# EasyEDA schematic SCH_AudioSwitcher_2026-03-13.json
TITLE: Audio Switcher; REV: 1.0; Date: 2026-03-10; Sheet: 1/1; Drawn By: CBH; Company: no
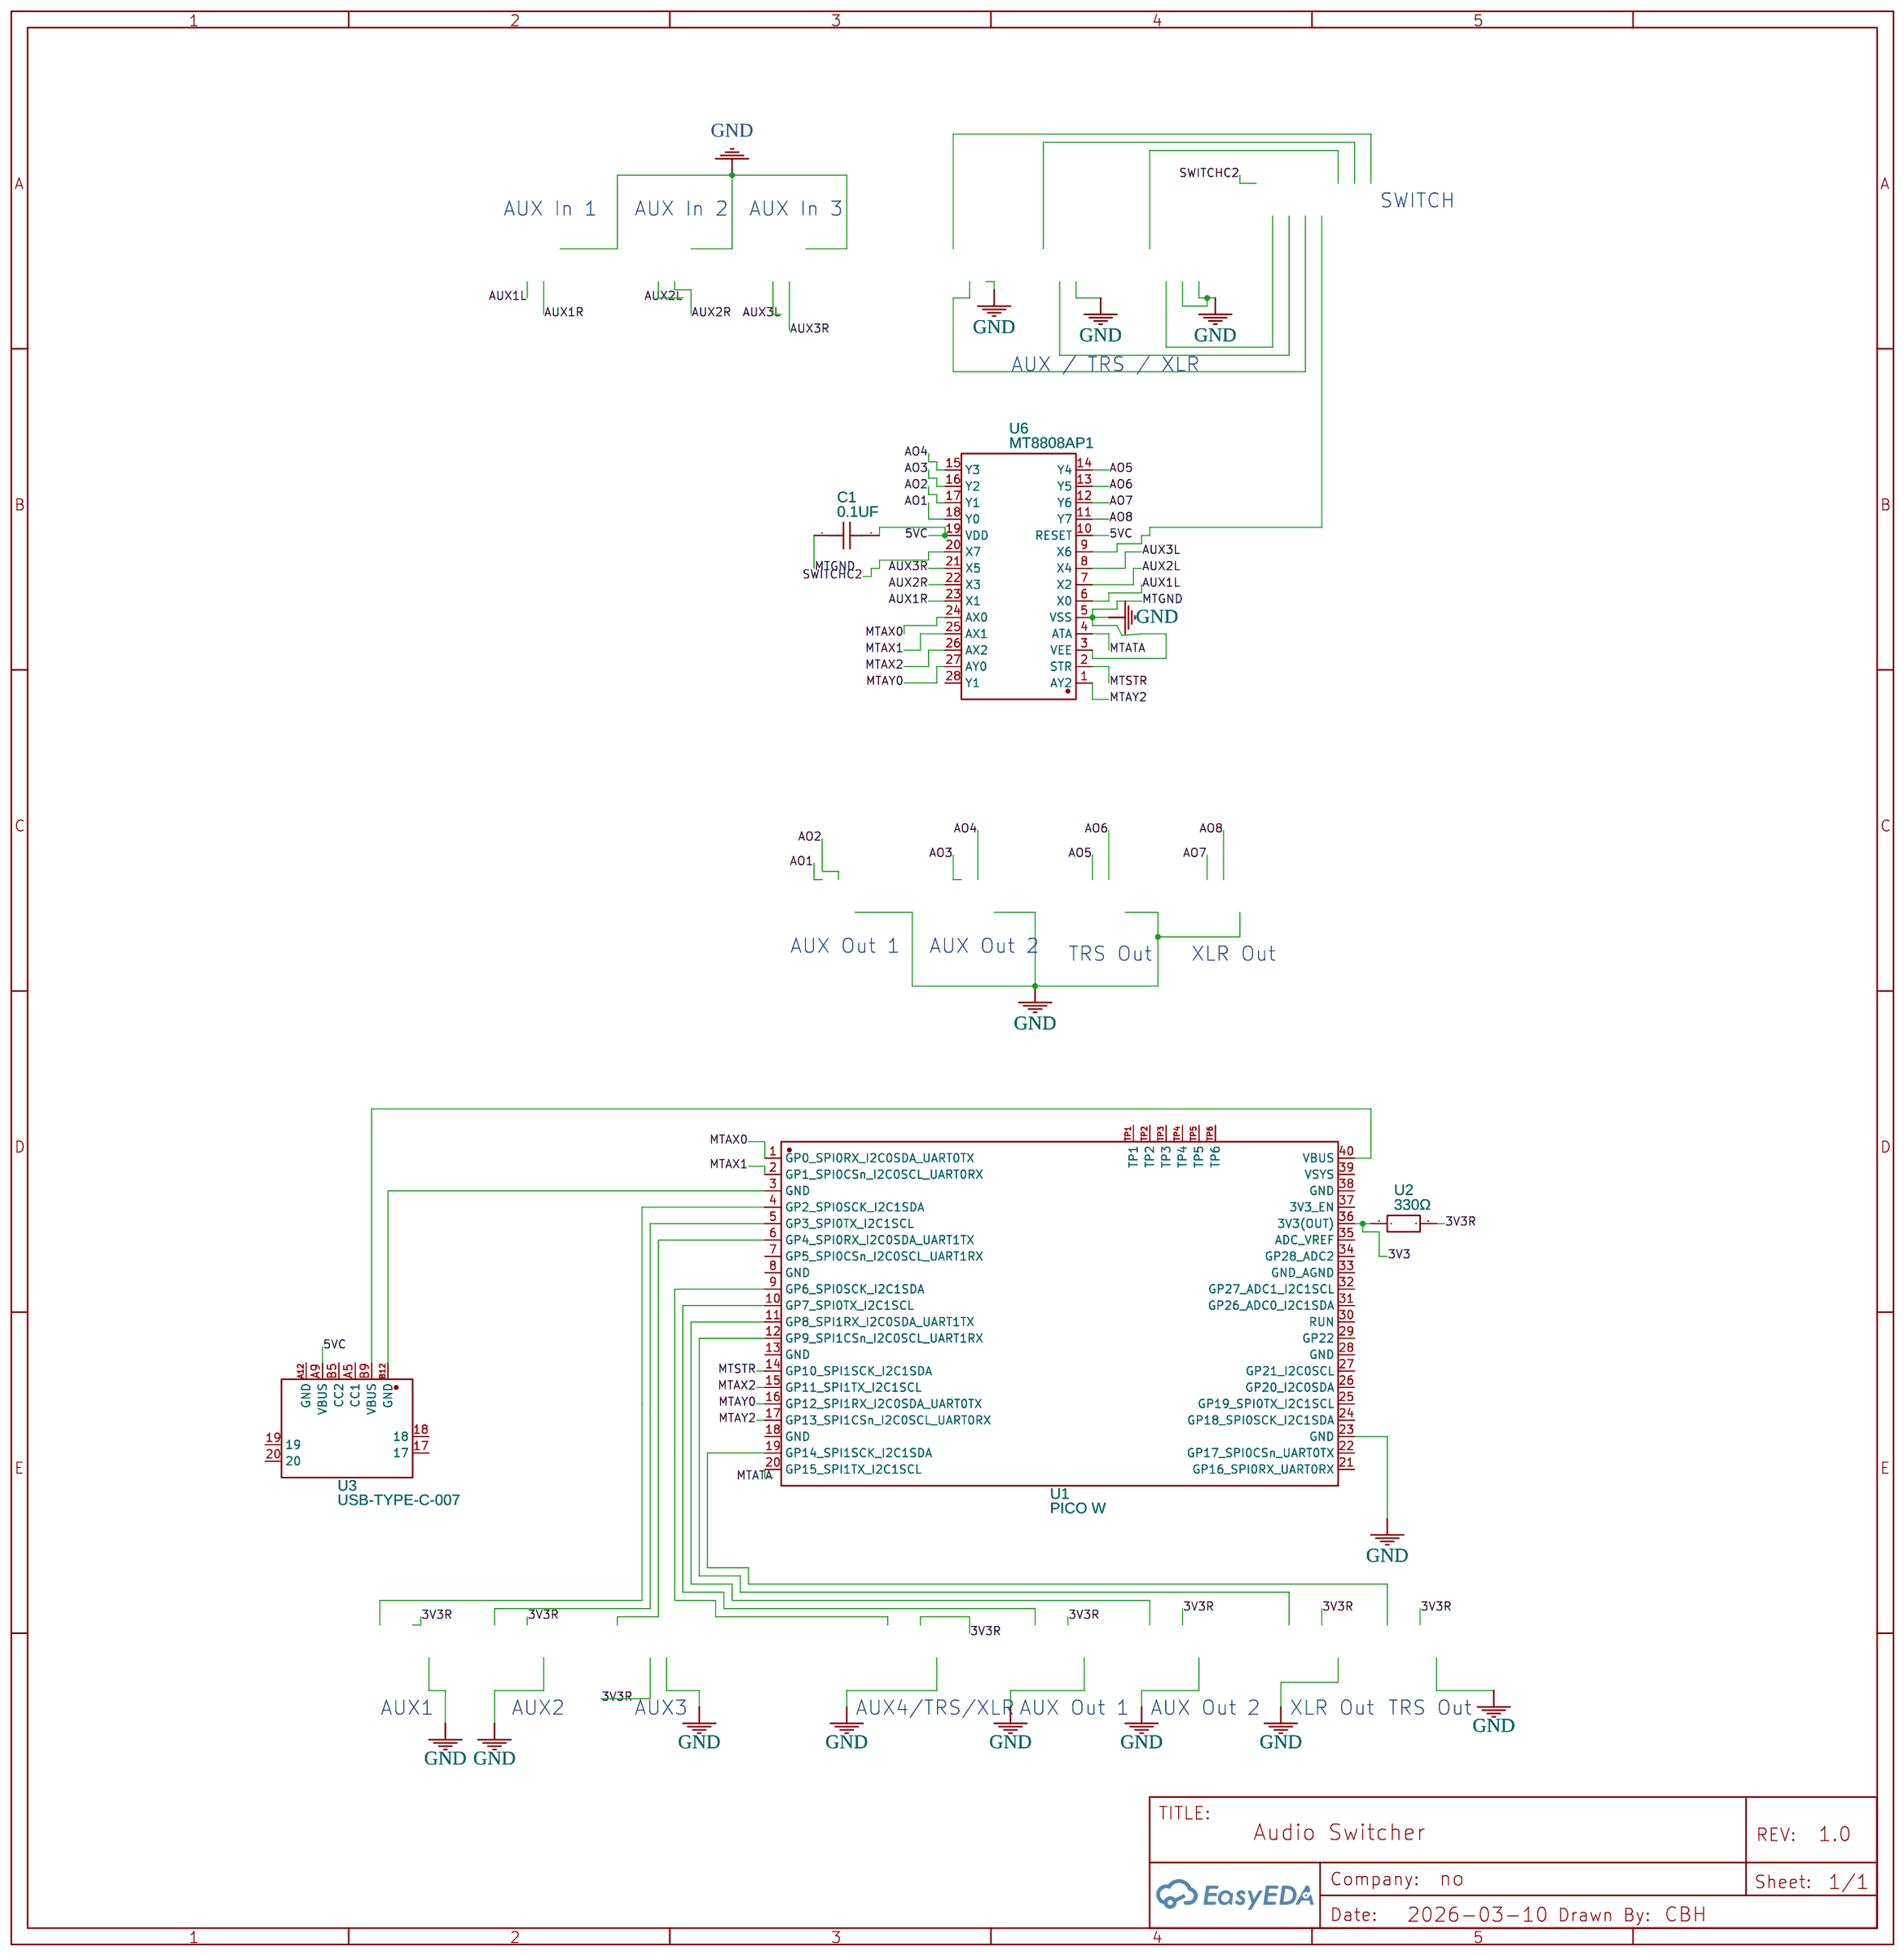
[diagram p0: schematic sheet]

## Parts
C1  0.1UF  [CAP-TH_L10.0-W4.5-P7.50-D0.6]
U1  PICO W  [COMM-SMD_L51.0-W21.0-P2.54_PICOW]
U2  330Ω  [R0603]
U3  USB-TYPE-C-007  [TYPE-C-SMD_USB-TYPE-C-007]
U6  MT8808AP1  [PLCC-28_L11.5-W11.5-P1.27-LS12.5-L]

## Library data of the parts
C1 = 250V 0.1UF 5% CBBCapacitor: Supplier: LCSC; Manufacturer: ReliaPro; Supplier Part: C46804; JLCPCB Part Class: Extended Part
U1 = PICO W: Supplier: LCSC; Supplier Part: C7203003; Manufacturer: Raspberry Pi(树莓派); Contributor: lcsc; JLCPCB Part Class: Extended Part
U2 = SCR0603J330R: Supplier: LCSC; Supplier Part: C3017748; Manufacturer: VO(翔胜); JLCPCB Part Class: Extended Part; Contributor: lcsc
U3 = USB-TYPE-C-007: Contributor: lcsc; Supplier: LCSC; Supplier Part: C2927027; Manufacturer: DEALON(德艺隆); JLCPCB Part Class: Extended Part
U6 = MT8808AP1: Contributor: LCSC; Supplier: LCSC; Supplier Part: C1522707; Manufacturer: MICROCHIP(美国微芯); JLCPCB Part Class: Extended Part

## Nets
3V3: U1.36(3V3(OUT)) U2.1
3V3R: U2.2
5VC: C1.2 U3.A9(VBUS) U6.10(RESET) U6.19(VDD)
GND: C1.1 U1.23(GND) U6.3(VEE) U6.5(VSS)
AO1: U6.18(Y0)
AO2: U6.17(Y1)
AO3: U6.16(Y2)
AO4: U6.15(Y3)
AO5: U6.14(Y4)
AO6: U6.13(Y5)
AO7: U6.12(Y6)
AO8: U6.11(Y7)
AUX1L: U6.6(X0)
AUX1R: U6.23(X1)
AUX2L: U6.7(X2)
AUX2R: U6.22(X3)
AUX3L: U6.8(X4)
AUX3R: U6.21(X5)
MTATA: U1.20(GP15_SPI1TX_I2C1SCL) U6.4(ATA)
MTAX0: U1.1(GP0_SPI0RX_I2C0SDA_UART0TX) U6.24(AX0)
MTAX1: U1.2(GP1_SPI0CSn_I2C0SCL_UART0RX) U6.25(AX1)
MTAX2: U1.15(GP11_SPI1TX_I2C1SCL) U6.26(AX2)
MTAY0: U1.16(GP12_SPI1RX_I2C0SDA_UART0TX) U6.27(AY0)
MTAY2: U1.17(GP13_SPI1CSn_I2C0SCL_UART0RX) U6.1(AY2)
MTSTR: U1.14(GP10_SPI1SCK_I2C1SDA) U6.2(STR)
SWITCHC2: U6.20(X7)
Net-(U1-3): U1.3(GND) U3.B12(GND)
Net-(U1-40): U1.40(VBUS) U3.B9(VBUS)

Not connected (* = marked no-connect by the designer): U1 4(GP2_SPI0SCK_I2C1SDA) 5(GP3_SPI0TX_I2C1SCL) 6(GP4_SPI0RX_I2C0SDA_UART1TX) 7(GP5_SPI0CSn_I2C0SCL_UART1RX) 8(GND) 9(GP6_SPI0SCK_I2C1SDA) 10(GP7_SPI0TX_I2C1SCL) 11(GP8_SPI1RX_I2C0SDA_UART1TX) 12(GP9_SPI1CSn_I2C0SCL_UART1RX) 13(GND) 18(GND) 19(GP14_SPI1SCK_I2C1SDA) 21(GP16_SPI0RX_UART0RX) 22(GP17_SPI0CSn_UART0TX) 24(GP18_SPI0SCK_I2C1SDA) 25(GP19_SPI0TX_I2C1SCL) 26(GP20_I2C0SDA) 27(GP21_I2C0SCL) 28(GND) 29(GP22) 30(RUN) 31(GP26_ADC0_I2C1SDA) 32(GP27_ADC1_I2C1SCL) 33(GND_AGND) 34(GP28_ADC2) 35(ADC_VREF) 37(3V3_EN) 38(GND) 39(VSYS) TP1 TP2 TP3 TP4 TP5 TP6; U3 17 18 19 20 A5(CC1) A12(GND) B5(CC2); U6 9(X6) 28(Y1)

## Notes on the sheet
- SWITCH
- AUX In 1
- AUX In 2
- AUX In 3
- AUX / TRS / XLR
- AUX Out 1
- AUX Out 2
- TRS Out
- XLR Out
- AUX1
- AUX2
- AUX3
- AUX4/TRS/XLR
- AUX Out 1
- AUX Out 2
- XLR Out
- TRS Out
